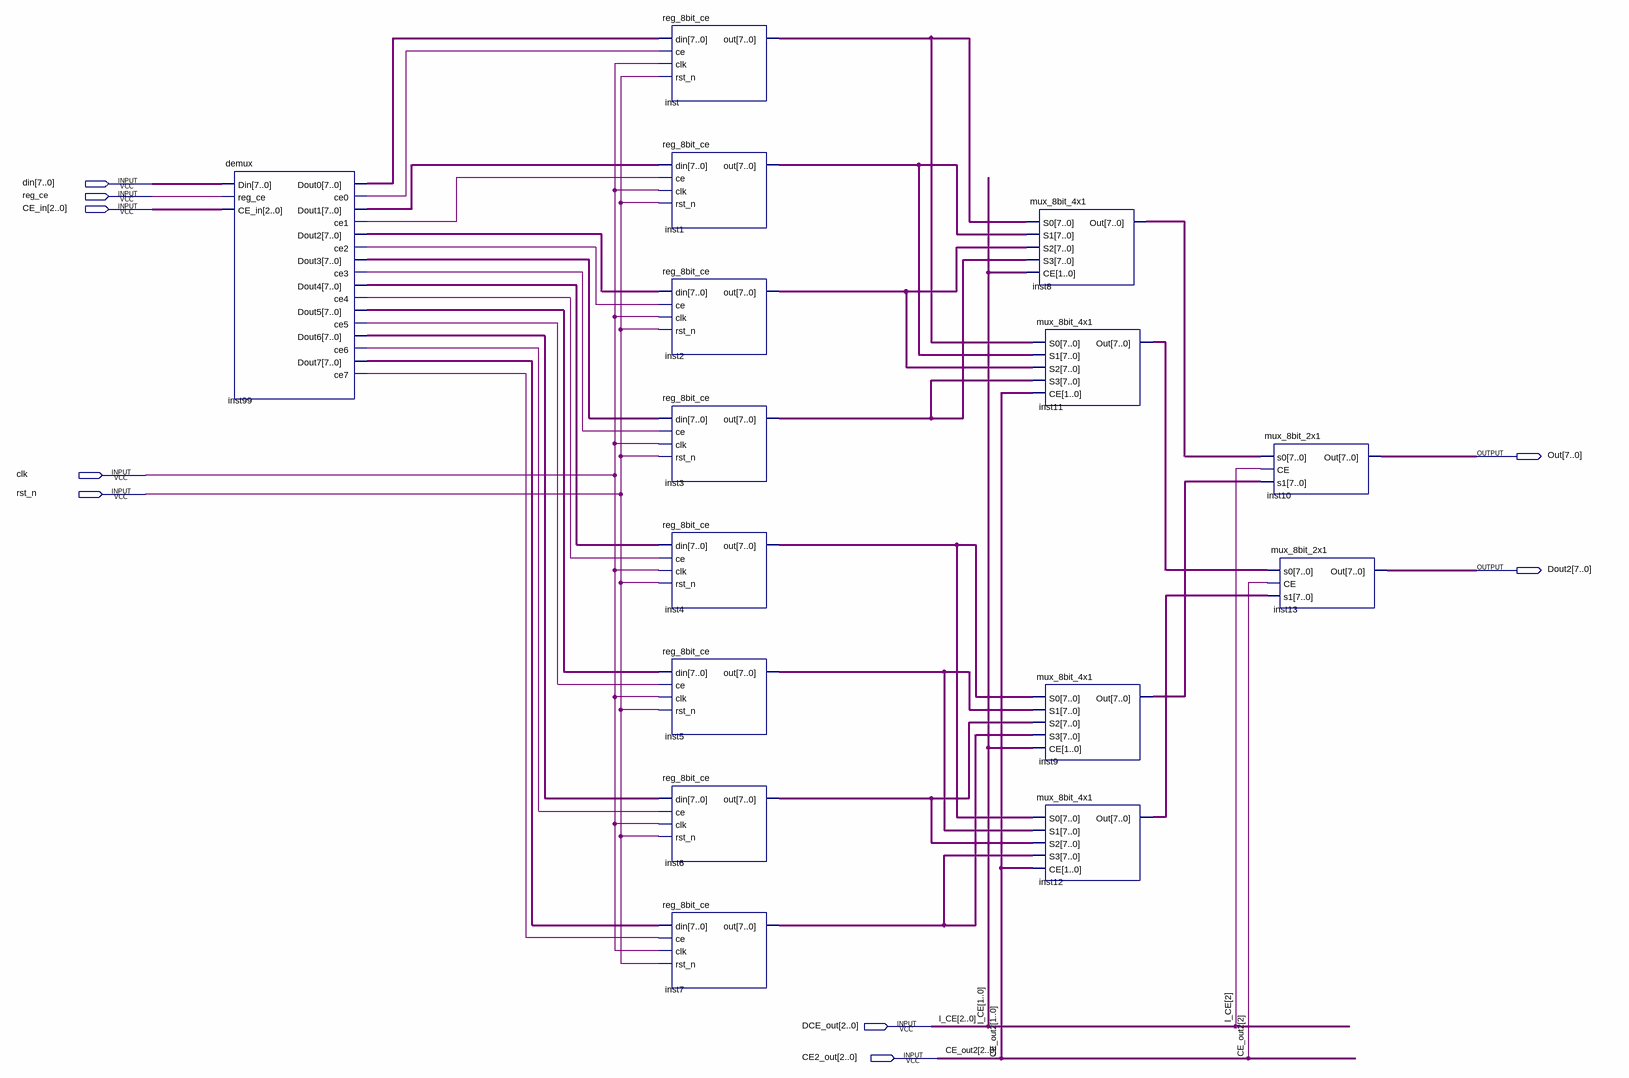
[diagram p0: schematic sheet]
// Quartus schematic sram_8bitx8.bdf as structural Verilog: 15 symbols, 9 pins
module sram_8bitx8 (
  input  [7:0] din,
  input  reg_ce,
  input  [2:0] CE_in,
  input  clk,
  input  rst_n,
  input  [2:0] DCE_out,
  input  [2:0] CE2_out,
  output [7:0] Out,
  output [7:0] Dout2
);

  wire inst99_ce0, inst99_ce1, inst99_ce2, inst99_ce3, inst99_ce4, inst99_ce5, inst99_ce6, inst99_ce7;
  wire [7:0] inst1_out, inst2_out, inst3_out, inst4_out, inst5_out, inst6_out, inst7_out, inst8_out,
       inst9_out, inst11_out, inst12_out, inst99_dout0, inst99_dout1, inst99_dout2, inst99_dout3,
       inst99_dout4, inst99_dout5, inst99_dout6, inst99_dout7, inst_out;

  demux inst99 (
    .Din(din), .reg_ce(reg_ce), .CE_in(CE_in), .Dout0(inst99_dout0), .ce0(inst99_ce0), .Dout1(inst99_dout1),
    .ce1(inst99_ce1), .Dout2(inst99_dout2), .ce2(inst99_ce2), .Dout3(inst99_dout3), .ce3(inst99_ce3),
    .Dout4(inst99_dout4), .ce4(inst99_ce4), .Dout5(inst99_dout5), .ce5(inst99_ce5), .Dout6(inst99_dout6),
    .ce6(inst99_ce6), .Dout7(inst99_dout7), .ce7(inst99_ce7));
  reg_8bit_ce inst (.din(inst99_dout0), .ce(inst99_ce0), .clk(clk), .rst_n(rst_n), .out(inst_out));
  reg_8bit_ce inst1 (.din(inst99_dout1), .ce(inst99_ce1), .clk(clk), .rst_n(rst_n), .out(inst1_out));
  reg_8bit_ce inst2 (.din(inst99_dout2), .ce(inst99_ce2), .clk(clk), .rst_n(rst_n), .out(inst2_out));
  reg_8bit_ce inst3 (.din(inst99_dout3), .ce(inst99_ce3), .clk(clk), .rst_n(rst_n), .out(inst3_out));
  reg_8bit_ce inst4 (.din(inst99_dout4), .ce(inst99_ce4), .clk(clk), .rst_n(rst_n), .out(inst4_out));
  reg_8bit_ce inst5 (.din(inst99_dout5), .ce(inst99_ce5), .clk(clk), .rst_n(rst_n), .out(inst5_out));
  reg_8bit_ce inst6 (.din(inst99_dout6), .ce(inst99_ce6), .clk(clk), .rst_n(rst_n), .out(inst6_out));
  reg_8bit_ce inst7 (.din(inst99_dout7), .ce(inst99_ce7), .clk(clk), .rst_n(rst_n), .out(inst7_out));
  mux_8bit_4x1 inst8 (
    .S0(inst_out), .S1(inst1_out), .S2(inst2_out), .S3(inst3_out), .CE(DCE_out[1:0]), .Out(inst8_out));
  mux_8bit_4x1 inst11 (
    .S0(inst_out), .S1(inst1_out), .S2(inst2_out), .S3(inst3_out), .CE(CE2_out[1:0]), .Out(inst11_out));
  mux_8bit_4x1 inst9 (
    .S0(inst4_out), .S1(inst5_out), .S2(inst6_out), .S3(inst7_out), .CE(DCE_out[1:0]), .Out(inst9_out));
  mux_8bit_4x1 inst12 (
    .S0(inst4_out), .S1(inst5_out), .S2(inst6_out), .S3(inst7_out), .CE(CE2_out[1:0]), .Out(inst12_out));
  mux_8bit_2x1 inst10 (.s0(inst8_out), .CE(DCE_out[2]), .s1(inst9_out), .Out(Out));
  mux_8bit_2x1 inst13 (.s0(inst11_out), .CE(CE2_out[2]), .s1(inst12_out), .Out(Dout2));

  // Other names for the same wires on the sheet: CE_out2[2:0] = CE2_out; l_CE[2:0] = DCE_out
endmodule
